# Altium project iC_NQI.PrjPcb
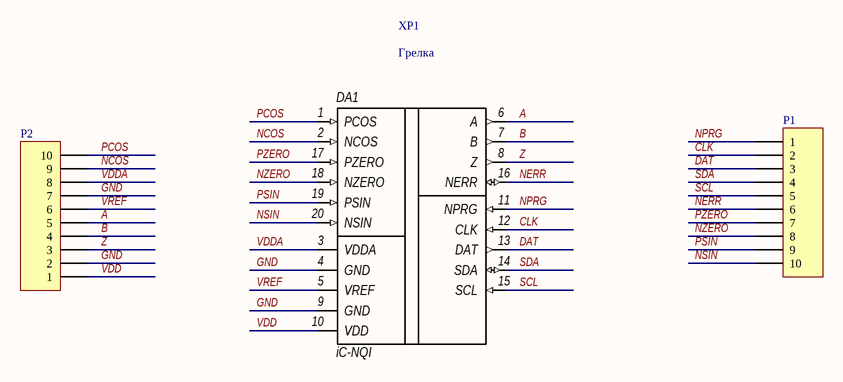
[diagram p0: Sheet1_NQI_MEZ.SchDoc]
1 sheet, 4 parts. Net scope: global (net labels, ports and power ports of the same name join across sheets).
Board file: PCB1_NQI_MEZ.PcbDoc

## Sheet Sheet1_NQI_MEZ.SchDoc
size A3; SheetNumber: 1; SheetTotal: 1

### Parts
DA1  iC-NQI  [iC-NQI]
P1  Header 10  [HDR1X10]  (value not drawn)
P2  Header 10  [HDR1X10]  (value not drawn)
XP1  Грелка  [Грелка]

### Nets
A: DA1.6(A) P2.5
B: DA1.7(B) P2.4
CLK: DA1.12(CLK) P1.2
DAT: DA1.13(DAT) P1.3
GND: DA1.4(GND) DA1.9(GND) P2.2 P2.7
NCOS: DA1.2(NCOS) P2.9
NERR: DA1.16(NERR) P1.6
NPRG: DA1.11(NPRG) P1.1
NSIN: DA1.20(NSIN) P1.10
NZERO: DA1.18(NZERO) P1.8
PCOS: DA1.1(PCOS) P2.10
PSIN: DA1.19(PSIN) P1.9
PZERO: DA1.17(PZERO) P1.7
SCL: DA1.15(SCL) P1.5
SDA: DA1.14(SDA) P1.4
VDD: DA1.10(VDD) P2.1
VDDA: DA1.3(VDDA) P2.8
VREF: DA1.5(VREF) P2.6
Z: DA1.8(Z) P2.3

### Library data of the parts
DA1 = iC-NQI: Оптический энкодер
P1 P2 = Header 10: Header, 10-Pin; LatestRevisionDate: 17-Jul-2002; LatestRevisionNote: Re-released for DXP Platform.; Publisher: Altium Limited